# Altium schematic sheet MCU_SchDoc.SchDoc
size A4
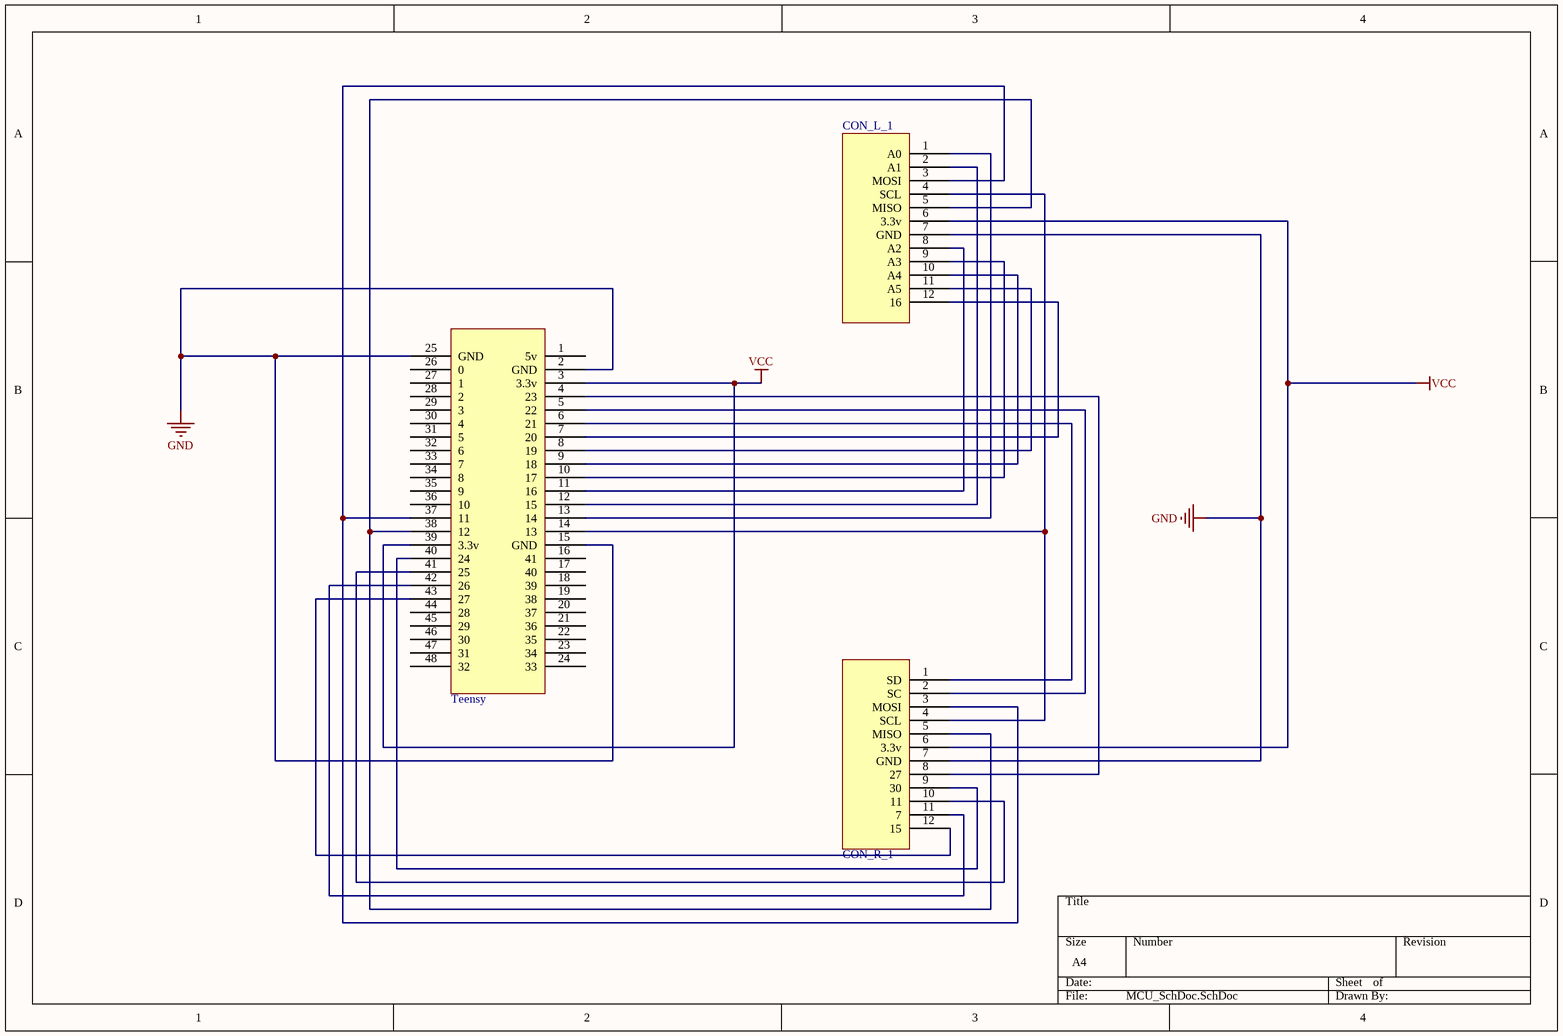
[diagram p0: MCU_SchDoc.SchDoc]

## Parts
?  Teensy  [Teensy]
CON_L_1  PIN_left  [PIN_left]  (value not drawn)
CON_R_1  PIN_right  [PIN_RIGHT]  (value not drawn)

## Nets
GND: ?.2(GND) ?.15(GND) ?.25(GND) CON_L_1.7(GND) CON_R_1.7(GND)
VCC: ?.3(3.3v) ?.39(3.3v) CON_L_1.6(3.3v) CON_R_1.6(3.3v)
Net?_4: ?.4(23) CON_R_1.8(27)
Net?_5: ?.5(22) CON_R_1.2(SC)
Net?_6: ?.6(21) CON_R_1.1(SD)
Net?_7: ?.7(20) CON_L_1.12(16)
Net?_8: ?.8(19) CON_L_1.11(A5)
Net?_9: ?.9(18) CON_L_1.10(A4)
Net?_10: ?.10(17) CON_L_1.9(A3)
Net?_11: ?.11(16) CON_L_1.8(A2)
Net?_12: ?.12(15) CON_L_1.2(A1)
Net?_13: ?.13(14) CON_L_1.1(A0)
Net?_14: ?.14(13) CON_L_1.4(SCL) CON_R_1.4(SCL)
Net?_37: ?.37(11) CON_L_1.3(MOSI) CON_R_1.3(MOSI)
Net?_38: ?.38(12) CON_L_1.5(MISO) CON_R_1.5(MISO)
Net?_40: ?.40(24) CON_R_1.9(30)
Net?_41: ?.41(25) CON_R_1.10(11)
Net?_42: ?.42(26) CON_R_1.11(7)
Net?_43: ?.43(27) CON_R_1.12(15)

Not connected (* = marked no-connect by the designer): ? 1(5v) 16(41) 17(40) 18(39) 19(38) 20(37) 21(36) 22(35) 23(34) 24(33) 26(0) 27(1) 28(2) 29(3) 30(4) 31(5) 32(6) 33(7) 34(8) 35(9) 36(10) 44(28) 45(29) 46(30) 47(31) 48(32)

## Library data of the parts
? = Teensy: IC